# Altium schematic sheet Placa_Motor_Esquematico.SchDoc
size A3
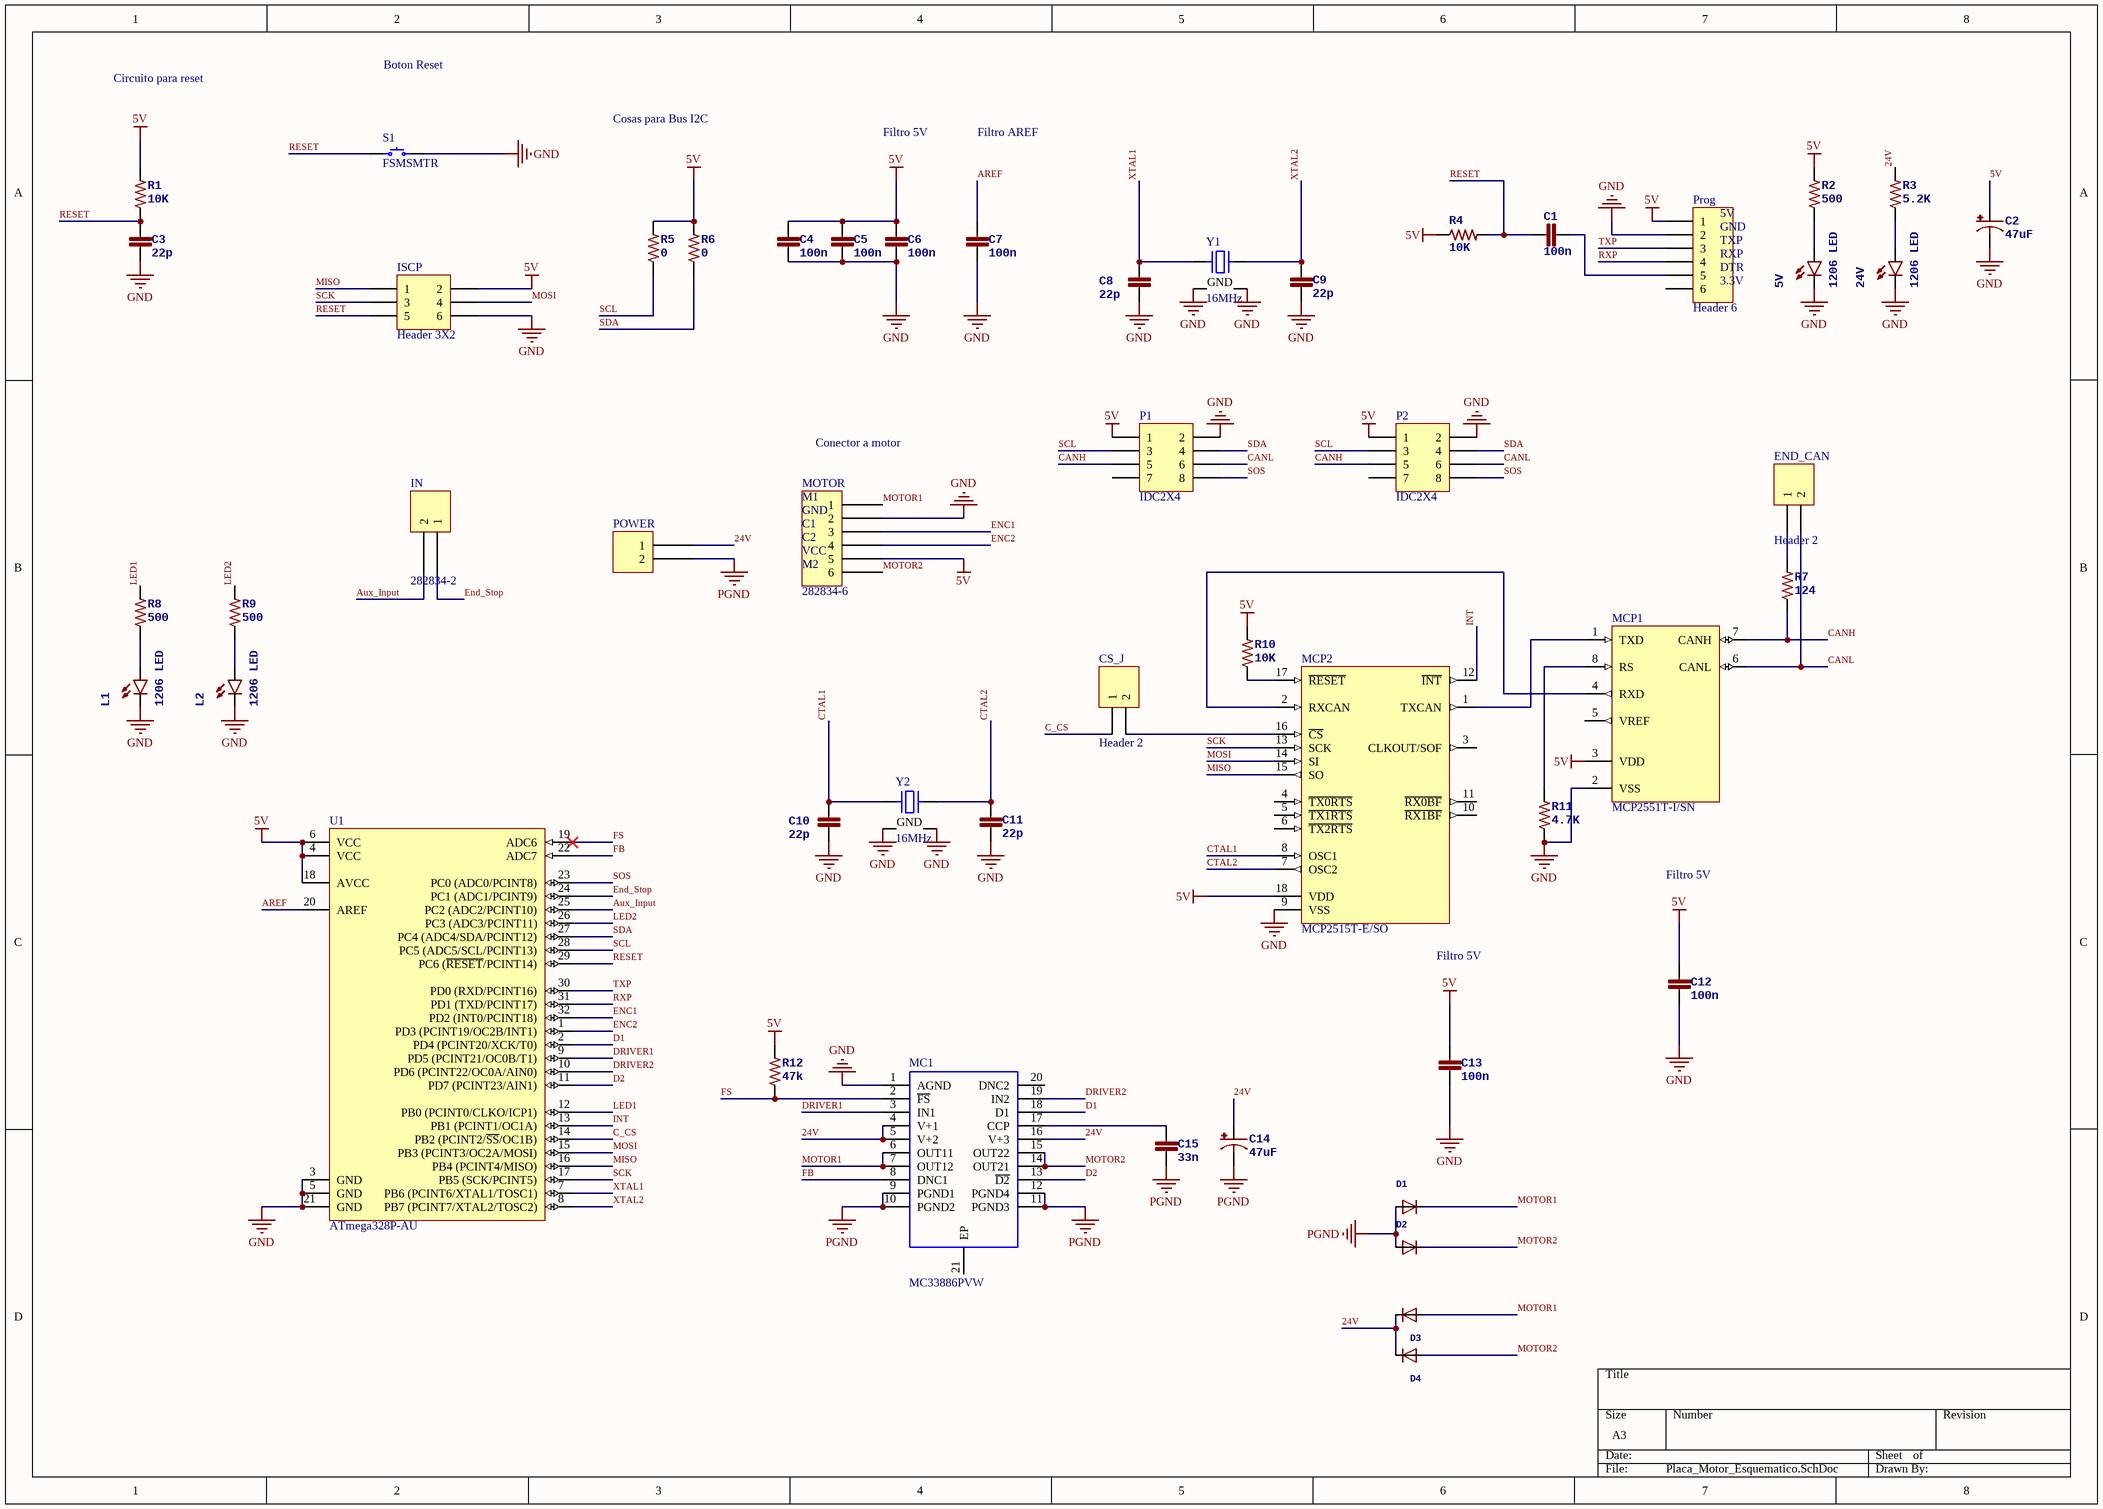
[diagram p0: Placa_Motor_Esquematico.SchDoc]

## Parts
5V  1206 LED  [LED-1206]
24V  1206 LED  [LED-1206]
C1  100n  [0805]
C2  47uF  [PANASONIC_D]
C3  22p  [0805]
C4  100n  [0805]
C5  100n  [0805]
C6  100n  [0805]
C7  100n  [0805]
C8  22p  [0805]
C9  22p  [0805]
C10  22p  [0805]
C11  22p  [0805]
C12  100n  [0805]
C13  100n  [0805]
C14  47uF  [PANASONIC_D]
C15  33n  [0805]
CS_J  Header 2  [HDR1X2]
D1  SBR3U40P1-7  [POWERDI-123]  (value not drawn)
D2  SBR3U40P1-7  [POWERDI-123]  (value not drawn)
D3  SBR3U40P1-7  [POWERDI-123]  (value not drawn)
D4  SBR3U40P1-7  [POWERDI-123]  (value not drawn)
END_CAN  Header 2  [HDR1X2]
IN  282834-2  [TE 282834-2]
ISCP  Header 3X2  [HDR2X3]
L1  1206 LED  [LED-1206]
L2  1206 LED  [LED-1206]
MC1  MC33886PVW  [SOIC127P1420X340-21N]
MCP1  MCP2551T-I/SN  [SOIC-SN8_N]
MCP2  MCP2515T-E/SO  [SOIC-SO18_N]
MOTOR  282834-6  [TE 282834-6]
P1  IDC2X4  [IDC2X4]
P2  IDC2X4  [IDC2X4]
POWER  20020110-D021A01LF  [FCI 06-381-2PIN]  (value not drawn)
Prog  Header 6  [HDR1X6]
R1  10K  [0805]
R2  500  [0805]
R3  5.2K  [0805]
R4  10K  [0805]
R5  0  [0805]
R6  0  [0805]
R7  124  [0805]
R8  500  [0805]
R9  500  [0805]
R10  10K  [0805]
R11  4.7K  [0805]
R12  47k  [0805]
S1  FSMSMTR  [TE FSMSMTR]
U1  ATmega328P-AU  [32A_N]
Y1  16MHz  [NDK NX3225SA]
Y2  16MHz  [NDK NX3225SA]

## Nets
5V: C2.+ C4.1 C5.1 C6.1 C12.1 C13.1 ISCP.2 MCP1.3(VDD) MCP2.18(VDD) MOTOR.5 P1.1 P2.1 Prog.1 R1.2 R2.2 R4.1 R5.2 R6.2 R10.2 R12.2 U1.4(VCC) U1.6(VCC) U1.18(AVCC)
GND: 5V.C 24V.C C2.- C3.2 C4.2 C5.2 C6.2 C7.2 C8.2 C9.2 C10.2 C11.2 C12.2 C13.2 ISCP.6 L1.C L2.C MC1.1(AGND) MCP1.2(VSS) MCP2.9(VSS) MOTOR.2 P1.2 P2.2 Prog.2 R11.1 S1.2 U1.3(GND) U1.5(GND) U1.21(GND) Y1.2(GND) Y1.4(GND) Y2.2(GND) Y2.4(GND)
PGND: C14.- C15.2 D1.A D2.A MC1.9(PGND1) MC1.10(PGND2) MC1.11(PGND3) MC1.12(PGND4) POWER.2
24V: C14.+ D3.C D4.C MC1.4(V+1) MC1.5(V+2) MC1.16(V+3) POWER.1 R3.2
AREF: C7.1 U1.20(AREF)
Aux_Input: IN.2 U1.25(PC2_(ADC2/PCINT10))
C_CS: CS_J.1 U1.14(PB2_(PCINT2/~{SS}/OC1B))
CANH: MCP1.7(CANH) P1.5 P2.5 R7.1
CANL: END_CAN.2 MCP1.6(CANL) P1.6 P2.6
CTAL1: C10.1 MCP2.8(OSC1) Y2.1
CTAL2: C11.1 MCP2.7(OSC2) Y2.3
D1: MC1.18(D1) U1.2(PD4_(PCINT20/XCK/T0))
D2: MC1.13(~{D2}) U1.11(PD7_(PCINT23/AIN1))
DRIVER1: MC1.3(IN1) U1.9(PD5_(PCINT21/OC0B/T1))
DRIVER2: MC1.19(IN2) U1.10(PD6_(PCINT22/OC0A/AIN0))
ENC1: MOTOR.3 U1.32(PD2_(INT0/PCINT18))
ENC2: MOTOR.4 U1.1(PD3_(PCINT19/OC2B/INT1))
End_Stop: IN.1 U1.24(PC1_(ADC1/PCINT9))
FB: MC1.8(DNC1) U1.22(ADC7)
FS: MC1.2(~{FS}) R12.1 U1.19(ADC6)
INT: MCP2.12(~{INT}) U1.13(PB1_(PCINT1/OC1A))
LED1: R8.2 U1.12(PB0_(PCINT0/CLKO/ICP1))
LED2: R9.2 U1.26(PC3_(ADC3/PCINT11))
MISO: ISCP.1 MCP2.15(SO) U1.16(PB4_(PCINT4/MISO))
MOSI: ISCP.4 MCP2.14(SI) U1.15(PB3_(PCINT3/OC2A/MOSI))
MOTOR1: D1.C D3.A MC1.6(OUT11) MC1.7(OUT12) MOTOR.1
MOTOR2: D2.C D4.A MC1.14(OUT21) MC1.15(OUT22) MOTOR.6
RESET: C1.1 C3.1 ISCP.5 R1.1 R4.2 S1.1 U1.29(PC6_(~{RESET}/PCINT14))
RXP: Prog.4 U1.31(PD1_(TXD/PCINT17))
SCK: ISCP.3 MCP2.13(SCK) U1.17(PB5_(SCK/PCINT5))
SCL: P1.3 P2.3 R5.1 U1.28(PC5_(ADC5/SCL/PCINT13))
SDA: P1.4 P2.4 R6.1 U1.27(PC4_(ADC4/SDA/PCINT12))
SOS: P1.8 P2.8 U1.23(PC0_(ADC0/PCINT8))
TXP: Prog.3 U1.30(PD0_(RXD/PCINT16))
XTAL1: C8.1 U1.7(PB6_(PCINT6/XTAL1/TOSC1)) Y1.1
XTAL2: C9.1 U1.8(PB7_(PCINT7/XTAL2/TOSC2)) Y1.3
Net5V_A: 5V.A R2.1
Net24V_A: 24V.A R3.1
NetC1_2: C1.2 Prog.5
NetC15_1: C15.1 MC1.17(CCP)
NetCS_J_2: CS_J.2 MCP2.16(~{CS})
NetEND_CAN_1: END_CAN.1 R7.2
NetL1_A: L1.A R8.1
NetL2_A: L2.A R9.1
NetMCP1_1: MCP1.1(TXD) MCP2.1(TXCAN)
NetMCP1_4: MCP1.4(RXD) MCP2.2(RXCAN)
NetMCP1_8: MCP1.8(RS) R11.2
NetMCP2_17: MCP2.17(~{RESET}) R10.1

Not connected (* = marked no-connect by the designer): MC1 20(DNC2) 21(EP); MCP1 5(VREF); MCP2 3(CLKOUT/SOF) 4(~{TX0RTS}) 5(~{TX1RTS}) 6(~{TX2RTS}) 10(~{RX1BF}) 11(~{RX0BF}); P1 7; P2 7; Prog 6

## Notes on the sheet
- Circuito para reset
- Boton Reset
- Cosas para Bus I2C
- Filtro 5V
- Filtro AREF
- (near Prog) 5V
- (near Prog) GND
- (near Prog) TXP
- (near Prog) RXP
- (near Prog) DTR
- (near Prog) 3.3V
- Conector a motor
- (near MOTOR) M1
- (near MOTOR) GND
- (near MOTOR) C1
- (near MOTOR) C2
- (near MOTOR) VCC
- (near MOTOR) M2
- (near MCP2) Filtro 5V

## Library data of the parts
5V 24V L1 L2 = LED1206
C1 C3-C13 C15 = CAP0805
C2 C14 = 47UF-50V-20%(ELECT): PROD_ID: CAP-10547
CS_J END_CAN = Header 2: Header, 2-Pin; LatestRevisionDate: 17-Jul-2002; LatestRevisionNote: Re-released for DXP Platform.; Publisher: Altium Limited
D1-D4 = DFLS1100-7
IN = 282834-2: TERM BLOCK 2POS SIDE ENT 2.54MM; Manufacturer: TE Connectivity AMP Connectors; TemperatureRange: -40C ~ 105C; Voltage: 150V; Pitch: 0.100" (2.54mm); Number Of Levels: 1; Positions Per Level: 2; Part Number: 282834-2; PartId: 9289; Supplier 1: Digi-Key; Supplier Part Number 1: A98333-ND; ComponentLink1Description: Datasheet; ComponentLink1URL: http://www.te.com/commerce/DocumentDelivery/DDEController?Action=srchrtrv&DocNm=282834&DocType=Customer+Drawing&DocLang=English; ComponentLink2Description: Digi-Key Listing; ComponentLink2URL: http://www.digikey.ca/product-detail/en/282834-2/A98333-ND/1150135; Price: 1,3; Colour: Green; Orientation: Horizontal with Board
ISCP = Header 3X2: Header, 3-Pin, Dual row; LatestRevisionDate: 17-Jul-2002; LatestRevisionNote: Re-released for DXP Platform.; Publisher: Altium Limited
MC1 = MC33886PVW: Motor / Motion / Ignition Controllers & Drivers 5.0 A H-BRIDGE; Manufacturer_Name: NXP; Geometry.Height: 3.4mm; Manufacturer_Part_Number: MC33886PVW; RS Part Number: *; RS Price/Stock: *; Arrow Part Number: MC33886PVW; Arrow Price/Stock: *; Datasheet Link: https://www.nxp.com/docs/en/data-sheet/MC33886.pdf
MCP1 = MCP2551T-I/SN: High-Speed CAN Transceiver, 8-Pin SOIC, Industrial Temperature, Tape and Reel; Published: 29-Jan-2009; DatasheetVersion: revE, Jan-2007; PackageVersion: revBB, Aug-2009; PackageReference: SOIC-SN8; Publisher: Altium Limited; PackageDescription: 8-Lead Plastic Small Outline (SN) - Narrow, 3.90mm Body [SOIC]; Supplier 1: Digi-Key; Supplier Part Number 1: MCP2551T-I/SNTR-ND; Supplier 2: Farnell; Supplier Part Number 2: 1788569; Code_JEDEC: MS-012; Code_IPC: SOIC127P600-8; ComponentLink1Description: Datasheet; ComponentLink1URL: http://ww1.microchip.com/downloads/en/DeviceDoc/21667E.pdf; ComponentLink2Description: Packaging Specification; ComponentLink2URL: http://www.microchip.com/stellent/groups/techpub_sg/documents/packagingspec/en012702.pdf; ComponentLink3Description: Microchip.com Home; ComponentLink3URL: http://www.microchip.com/
MCP2 = MCP2515T-E/SO: Stand-Alone CAN Controller With SPI Interface, 18-Pin SOIC, Extended Temperature, Tape and Reel; Published: 29-Jan-2009; DatasheetVersion: revE, Nov-2007; PackageVersion: revBB, Aug-2009; PackageReference: SOIC-SO18; Publisher: Altium Limited; PackageDescription: 18-Lead Plastic Small Outline (SO) - Wide 7.50mm Body [SOIC]; Supplier 1: Digi-Key; Supplier Part Number 1: MCP2515T-E/SO-ND; Code_JEDEC: MS-013; ComponentLink1Description: Datasheet; ComponentLink1URL: http://ww1.microchip.com/downloads/en/DeviceDoc/21801e.pdf; ComponentLink2Description: Packaging Specification; ComponentLink2URL: http://www.microchip.com/stellent/groups/techpub_sg/documents/packagingspec/en012702.pdf; ComponentLink3Description: Microchip.com Home; ComponentLink3URL: http://www.microchip.com/
MOTOR = 282834-6: TERM BLOCK 6POS SIDE ENT 2.54MM; Manufacturer: TE Connectivity AMP Connectors; TemperatureRange: -40C ~ 105C; Voltage: 150V; Pitch: 0.100" (2.54mm); Number Of Levels: 1; Positions Per Level: 6; Part Number: 282834-6; PartId: 9293; Supplier 1: Digi-Key; Supplier Part Number 1: A98337-ND; ComponentLink1Description: Datasheet; ComponentLink1URL: http://www.te.com/commerce/DocumentDelivery/DDEController?Action=srchrtrv&DocNm=282834&DocType=Customer+Drawing&DocLang=English; ComponentLink2Description: Digi-Key Listing; ComponentLink2URL: http://www.digikey.ca/product-detail/en/282834-6/A98337-ND/1153267; Price: 4,82; Colour: Green; Orientation: Horizontal with Board
P1 P2 = IDC2X4: Header, 4-Pin, Dual row; LatestRevisionDate: 17-Jul-2002; LatestRevisionNote: Re-released for DXP Platform.; Publisher: Altium Limited
POWER = 20020110-D021A01LF: TERM BLOCK HDR 2POS R/A 3.81MM; Manufacturer: FCI; TemperatureRange: -40C ~ 115C; Voltage: 300V; Pitch: 0.150" (3.81mm); Number Of Positions: 2; Number Of Levels: 1; Part Number: 20020110-D021A01LF; PartId: 7785; Supplier 1: Digi-Key; Supplier Part Number 1: 609-3819-ND; ComponentLink1Description: Datasheet; ComponentLink1URL: http://portal.fciconnect.com/Comergent//fci/drawing/20020110.pdf; ComponentLink2Description: Digi-Key Listing; ComponentLink2URL: http://www.digikey.ca/product-detail/en/20020110-D021A01LF/609-3819-ND/2261255; Price: 0,75; Type: Through Hole; Colour: Green; Orientation: 90, Right Angle; Positions Per Level: 2
Prog = Header 6: Header, 6-Pin; LatestRevisionDate: 17-Jul-2002; LatestRevisionNote: Re-released for DXP Platform.; Publisher: Altium Limited
R1-R12 = RESISTOR0805-RES
S1 = FSMSMTR: SWITCH TACTILE SPST-NO 0.05A 24V; Manufacturer: TE Connectivity Alcoswitch Switches; Switch Function: Off-Mom; Contact Rating @ Voltage: 0.05A @ 24VDC; Actuator Type: Standard; Actuator Orientation: Top Actuated; Illumination: Non-Illuminated; Operating Force: 180gf; Switch Travel: 0.25mm; Mechanical Life: 20,000 Cycles; Part Number: FSMSMTR; PartId: 8251; Supplier 1: Digi-Key; Supplier Part Number 1: 450-1758-2-ND; ComponentLink1Description: Datasheet; ComponentLink1URL: http://www.te.com/commerce/DocumentDelivery/DDEController?Action=srchrtrv&DocNm=1437566-3&DocType=Customer+Drawing&DocLang=English; ComponentLink2Description: Digi-Key Listing; ComponentLink2URL: http://www.digikey.com/product-detail/en/FSMSMTR/450-1758-2-ND/529671; Price: 0,175; Circuit: SPST-NO; Illumination Voltage: -; Illumination Type, Colour: -; Operating Temperature: -35C ~ 85C
U1 = ATmega328P-AU: 8-bit AVR Microcontroller, 32KB Flash, 1KB EEPROM, 2KB SRAM, 32-pin TQFP, Industrial Grade (-40°C to 85°C); Published: 1-Apr-2010; DatasheetVersion: revA, Jan-2010; PackageVersion: revB, Oct-2001; PackageReference: 32A; Publisher: Altium Limited; PackageDescription: 32-Lead, 7x7x1.0 mm Body, 0.8mm Lead Pitch, Thin Profile Plastic Quad Flat Package (TQFP); Supplier 1: Digi-Key; Supplier Part Number 1: ATMEGA328P-AU-ND; Supplier 2: Farnell; Supplier Part Number 2: 1715486; Supplier 3: Mouser; Supplier Part Number 3: 556-ATMEGA328P-AU; Code_JEDEC: MS-026-ABA; ComponentLink1Description: Manufacturer Link; ComponentLink1URL: http://www.atmel.com/products/avr/default.asp?; ComponentLink2Description: ATmega48A/48PA/88A/88PA/168A/168PA/328/328P Datasheet; ComponentLink2URL: http://www.atmel.com/dyn/resources/prod_documents/8271.pdf; ComponentLink3Description: ATmega48A/48PA/88A/88PA/168A/168PA/328/328P Summary; ComponentLink3URL: http://www.atmel.com/dyn/resources/prod_documents/8271S.pdf; ComponentLink4Description: Atmel.com Home; ComponentLink4URL: http://www.atmel.com
Y1 Y2 = NX3225SA-16.000MHZ-STD-CSR-1: CRYSTAL 16.0000MHZ 8PF SMD; Manufacturer: NDK; Frequency Stability: 15ppm; ESR: 80 Ohm; Operating Mode: Fundamental; Part Number: NX3225SA-16.000MHZ-STD-CSR-1; PartId: 8509; Supplier 1: Digi-Key; Supplier Part Number 1: 644-1049-2-ND; ComponentLink1Description: Datasheet; ComponentLink1URL: http://media.digikey.com/pdf/Data%20Sheets/NDK%20PDFs/NX3225SA.pdf; ComponentLink2Description: Digi-Key Listing; ComponentLink2URL: http://www.digikey.com/product-detail/en/NX3225SA-16.000MHZ-STD-CSR-1/644-1049-2-ND/1128831; Price: 0,3799; Type: MHz Crystal; Device Package: 4-SMD, No Lead (DFN, LCC); Frequency: 16MHz; Frequency Tolerance: 15ppm; Load Capacitance: 8pF